# Altium project HardWare_Collect.PrjPcb
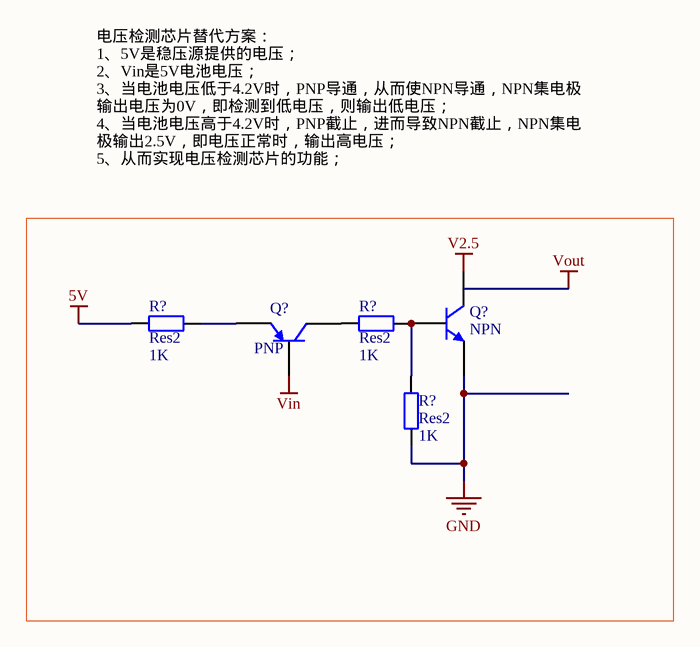
[diagram p0: LowVccDetect.SchDoc]
2 sheets, 9 parts. Net scope: global (net labels, ports and power ports of the same name join across sheets).
Sheets:
  LowVccDetect.SchDoc
  3.3V-5V.SchDoc

## Sheet LowVccDetect.SchDoc
size A4

### Parts
(Parts that share a designator on the sheet are numbered #1, #2 ... from top to bottom, then left to right.)
Q?#1  NPN  [TO-226-AA]
Q?#2  PNP  [SOT-23B_N]
R?#1  Res2  value 1K  [AXIAL-0.4]
R?#2  Res2  value 1K  [AXIAL-0.4]
R?#3  Res2  value 1K  [AXIAL-0.4]

### Nets
5V: R?#1.1
GND: Q?#1.3(E) R?#3.1
V2.5: Q?#1.1(C)
Vin: Q?#2.2(B)
NetQ?#1_2: Q?#1.2(B) R?#2.2 R?#3.2
NetQ?#2_1: Q?#2.1(C) R?#2.1
NetQ?#2_3: Q?#2.3(E) R?#1.2

### Notes on the sheet
- 电压检测芯片替代方案：
  1、5V是稳压源提供的电压；
  2、Vin是5V电池电压；
  3、当电池电压低于4.2V时，PNP导通，从而使NPN导通，NPN集电极输出电压为0V，即检测到低电压，则输出低电压；
  4、当电池电压高于4.2V时，PNP截止，进而导致NPN截止，NPN集电极输出2.5V，即电压正常时，输出高电压；
  5、从而实现电压检测芯片的功能；

### Library data of the parts
Q?#1 = NPN: NPN Bipolar Transistor; Published: 8-Jun-2000; LatestRevisionDate: 17-Jul-2002; LatestRevisionNote: Re-released for DXP Platform.; PackageReference: TO-226-AA; Publisher: Altium Limited; PackageDescription: TO, Flat Index; 3 In-Line, Axial Leads; Body Dia. 4.8mm; Leads 0.55 x 0.51 mm (max); Code_JEDEC: TO-226-AA
Q?#2 = PNP: PNP Bipolar Transistor; Published: 8-Jun-2000; LatestRevisionDate: 29-May-2009; LatestRevisionNote: IPC-7351 Footprint Added.; PackageVersion: Aug-1999; PackageReference: SOT-23B; Publisher: Altium Limited; PackageDescription: 3-Pin SOT-23 Package 0.95 mm Pitch, 2.4 mm Lead Span
R?#1-R?#3 = Res2: Resistor; Published: 8-Jun-2000; LatestRevisionDate: 17-Jul-2002; LatestRevisionNote: Re-released for DXP Platform.; PackageReference: AXIAL-0.4; Publisher: Altium Limited; PackageDescription: Axial Device, Thru-Hole; 2 Leads; 0.4 in Pin Spacing

## Sheet 3.3V-5V.SchDoc
size A4
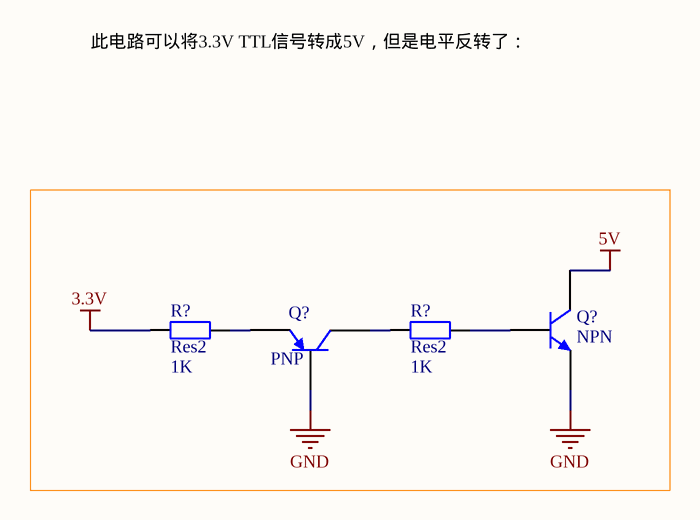
[diagram p1: 3.3V-5V.SchDoc]

### Parts
(Parts that share a designator on the sheet are numbered #1, #2 ... from top to bottom, then left to right.)
Q?#3  NPN  [TO-226-AA]
Q?#4  PNP  [SOT-23B_N]
R?#4  Res2  value 1K  [AXIAL-0.4]
R?#5  Res2  value 1K  [AXIAL-0.4]

### Nets
3.3V: R?#4.1
5V: Q?#3.1(C)
GND: Q?#3.3(E) Q?#4.2(B)
NetQ?#3_2: Q?#3.2(B) R?#5.2
NetQ?#4_1: Q?#4.1(C) R?#5.1
NetQ?#4_3: Q?#4.3(E) R?#4.2

### Notes on the sheet
- 此电路可以将3.3V TTL信号转成5V，但是电平反转了：

### Library data of the parts
Q?#3 = NPN: NPN Bipolar Transistor; Published: 8-Jun-2000; LatestRevisionDate: 17-Jul-2002; LatestRevisionNote: Re-released for DXP Platform.; PackageReference: TO-226-AA; Publisher: Altium Limited; PackageDescription: TO, Flat Index; 3 In-Line, Axial Leads; Body Dia. 4.8mm; Leads 0.55 x 0.51 mm (max); Code_JEDEC: TO-226-AA
Q?#4 = PNP: PNP Bipolar Transistor; Published: 8-Jun-2000; LatestRevisionDate: 29-May-2009; LatestRevisionNote: IPC-7351 Footprint Added.; PackageVersion: Aug-1999; PackageReference: SOT-23B; Publisher: Altium Limited; PackageDescription: 3-Pin SOT-23 Package 0.95 mm Pitch, 2.4 mm Lead Span
R?#4 R?#5 = Res2: Resistor; Published: 8-Jun-2000; LatestRevisionDate: 17-Jul-2002; LatestRevisionNote: Re-released for DXP Platform.; PackageReference: AXIAL-0.4; Publisher: Altium Limited; PackageDescription: Axial Device, Thru-Hole; 2 Leads; 0.4 in Pin Spacing

## Nets that join several sheets
5V: LowVccDetect (R?#1.1), 3.3V-5V (Q?#3.1)
GND: LowVccDetect (Q?#1.3 R?#3.1), 3.3V-5V (Q?#3.3 Q?#4.2)